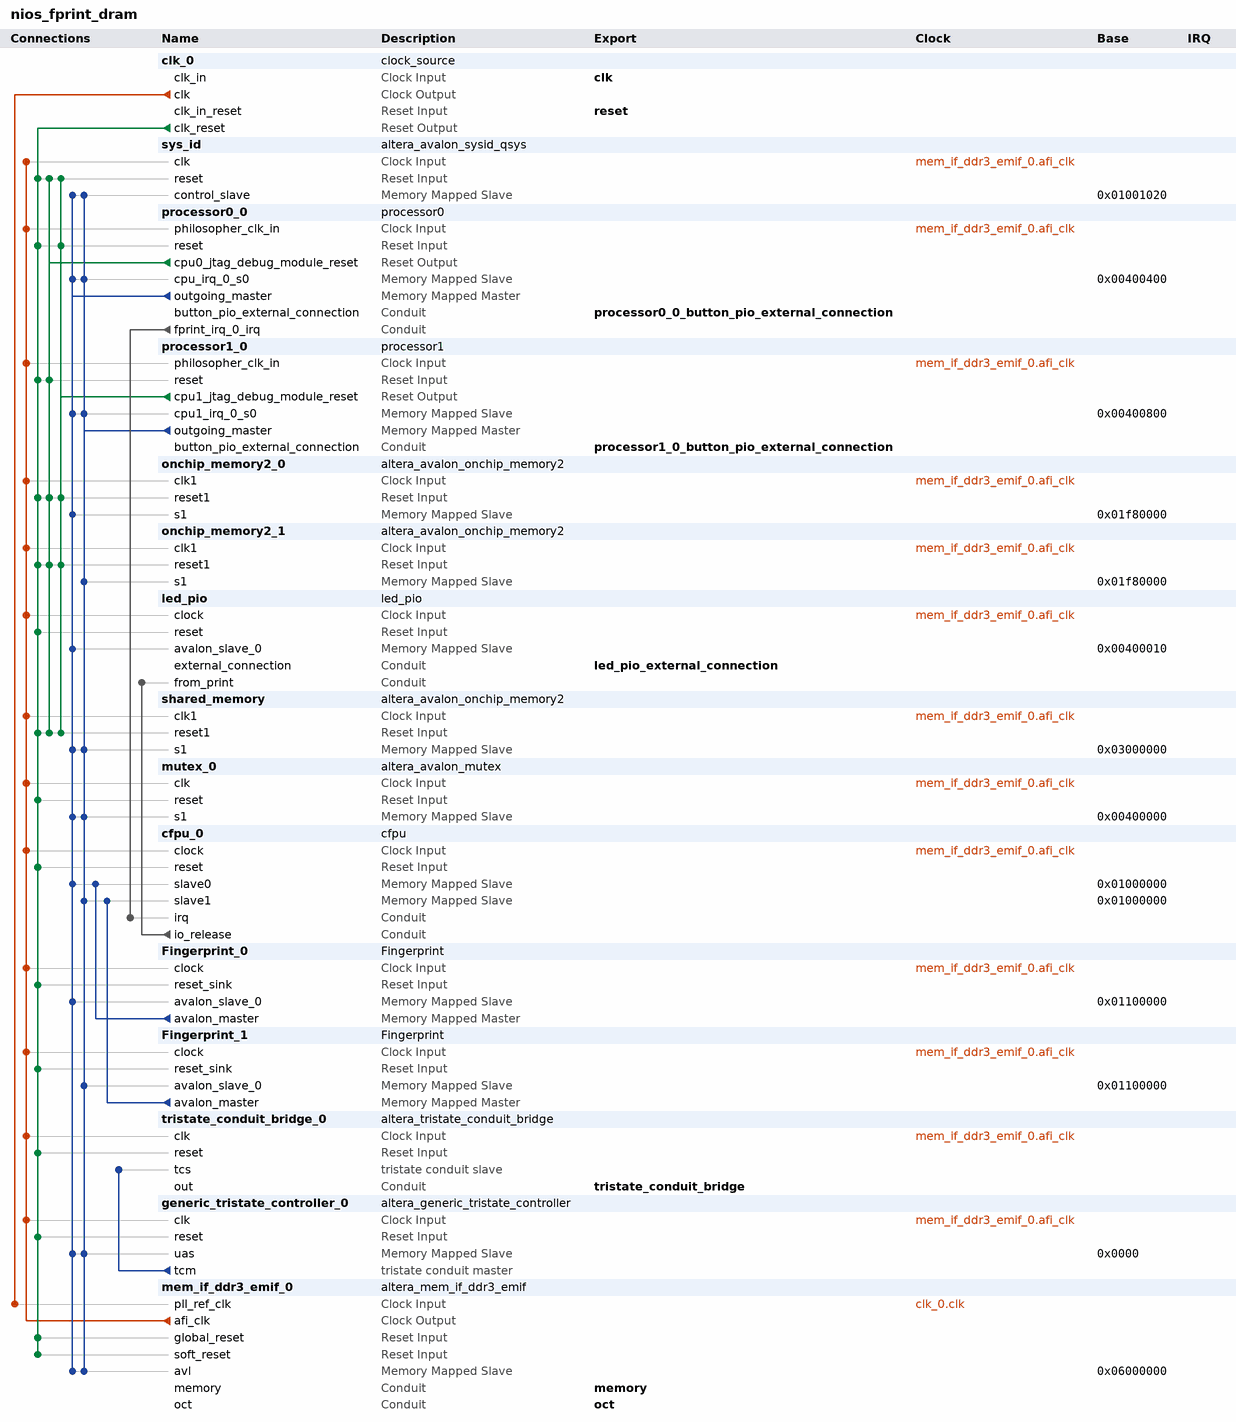
[diagram p0: system contents]
# Platform Designer (Qsys) system nios_fprint_dram, Arria V 5AGXFB3H4F35C5
# Parameters at their usual value, and those the tool derives, are not listed.
package require -exact qsys 13.0
create_system nios_fprint_dram
set_project_property DEVICE_FAMILY {Arria V}
set_project_property DEVICE 5AGXFB3H4F35C5

add_instance clk_0 clock_source 13.0
set_instance_parameter_value clk_0 clockFrequency 50000000

add_instance sys_id altera_avalon_sysid_qsys 13.0
set_instance_parameter_value sys_id id 0

add_instance processor0_0 processor0 1.0

add_instance processor1_0 processor1 1.0

add_instance onchip_memory2_0 altera_avalon_onchip_memory2 13.0.1.99.2
set_instance_parameter_value onchip_memory2_0 dataWidth 32
set_instance_parameter_value onchip_memory2_0 dualPort false
set_instance_parameter_value onchip_memory2_0 initMemContent true
set_instance_parameter_value onchip_memory2_0 initializationFileName onchip_mem.hex
set_instance_parameter_value onchip_memory2_0 memorySize 409600

add_instance onchip_memory2_1 altera_avalon_onchip_memory2 13.0.1.99.2
set_instance_parameter_value onchip_memory2_1 dataWidth 32
set_instance_parameter_value onchip_memory2_1 dualPort false
set_instance_parameter_value onchip_memory2_1 initMemContent true
set_instance_parameter_value onchip_memory2_1 initializationFileName onchip_mem.hex
set_instance_parameter_value onchip_memory2_1 memorySize 409600

add_instance led_pio led_pio 1.0

add_instance shared_memory altera_avalon_onchip_memory2 13.0.1.99.2
set_instance_parameter_value shared_memory dataWidth 32
set_instance_parameter_value shared_memory dualPort false
set_instance_parameter_value shared_memory initMemContent true
set_instance_parameter_value shared_memory initializationFileName onchip_mem.hex
set_instance_parameter_value shared_memory memorySize 1024

add_instance mutex_0 altera_avalon_mutex 13.0.1.99.2

add_instance cfpu_0 cfpu 1.0

add_instance Fingerprint_0 Fingerprint 1.0

add_instance Fingerprint_1 Fingerprint 1.0

add_instance tristate_conduit_bridge_0 altera_tristate_conduit_bridge 13.0

add_instance generic_tristate_controller_0 altera_generic_tristate_controller 13.0
set_instance_parameter_value generic_tristate_controller_0 TCM_ADDRESS_W 22
set_instance_parameter_value generic_tristate_controller_0 TCM_DATA_W 16
set_instance_parameter_value generic_tristate_controller_0 TCM_BYTEENABLE_W 2
set_instance_parameter_value generic_tristate_controller_0 TCM_READ_WAIT 100
set_instance_parameter_value generic_tristate_controller_0 TCM_WRITE_WAIT 100
set_instance_parameter_value generic_tristate_controller_0 TCM_SETUP_WAIT 25
set_instance_parameter_value generic_tristate_controller_0 TCM_DATA_HOLD 20
set_instance_parameter_value generic_tristate_controller_0 TCM_MAX_PENDING_READ_TRANSACTIONS 3
set_instance_parameter_value generic_tristate_controller_0 TCM_TURNAROUND_TIME 2
set_instance_parameter_value generic_tristate_controller_0 TCM_TIMING_UNITS 0
set_instance_parameter_value generic_tristate_controller_0 TCM_READLATENCY 2
set_instance_parameter_value generic_tristate_controller_0 TCM_SYMBOLS_PER_WORD 2
set_instance_parameter_value generic_tristate_controller_0 USE_READ 1
set_instance_parameter_value generic_tristate_controller_0 USE_BEGINTRANSFER 0
set_instance_parameter_value generic_tristate_controller_0 USE_BYTEENABLE 0
set_instance_parameter_value generic_tristate_controller_0 USE_OUTPUTENABLE 0
set_instance_parameter_value generic_tristate_controller_0 ACTIVE_LOW_READ 1
set_instance_parameter_value generic_tristate_controller_0 ACTIVE_LOW_BYTEENABLE 0
set_instance_parameter_value generic_tristate_controller_0 ACTIVE_LOW_OUTPUTENABLE 0
set_instance_parameter_value generic_tristate_controller_0 ACTIVE_LOW_BEGINTRANSFER 0
set_instance_parameter_value generic_tristate_controller_0 CHIPSELECT_THROUGH_READLATENCY 0
set_instance_parameter_value generic_tristate_controller_0 MODULE_ASSIGNMENT_KEYS embeddedsw.configuration.hwClassnameDriverSupportList,embeddedsw.configuration.hwClassnameDriverSupportDefault,embeddedsw.CMacro.SETUP_VALUE,embeddedsw.CMacro.WAIT_VALUE,embeddedsw.CMacro.HOLD_VALUE,embeddedsw.CMacro.TIMING_UNITS,embeddedsw.CMacro.SIZE,embeddedsw.memoryInfo.MEM_INIT_DATA_WIDTH,embeddedsw.memoryInfo.HAS_BYTE_LANE,embeddedsw.memoryInfo.IS_FLASH,embeddedsw.memoryInfo.GENERATE_DAT_SYM,embeddedsw.memoryInfo.GENERATE_FLASH,embeddedsw.memoryInfo.DAT_SYM_INSTALL_DIR,embeddedsw.memoryInfo.FLASH_INSTALL_DIR
set_instance_parameter_value generic_tristate_controller_0 MODULE_ASSIGNMENT_VALUES altera_avalon_lan91c111:altera_avalon_cfi_flash,altera_avalon_cfi_flash,25,100,20,ns,33554432u,16,1,1,1,1,SIM_DIR,APP_DIR
set_instance_parameter_value generic_tristate_controller_0 INTERFACE_ASSIGNMENT_KEYS embeddedsw.configuration.isFlash,embeddedsw.configuration.isMemoryDevice,embeddedsw.configuration.isNonVolatileStorage
set_instance_parameter_value generic_tristate_controller_0 INTERFACE_ASSIGNMENT_VALUES 1,1,1

add_instance mem_if_ddr3_emif_0 altera_mem_if_ddr3_emif 13.0
set_instance_parameter_value mem_if_ddr3_emif_0 MEM_VENDOR Micron
set_instance_parameter_value mem_if_ddr3_emif_0 MEM_FORMAT DISCRETE
set_instance_parameter_value mem_if_ddr3_emif_0 MEM_CLK_FREQ_MAX 666.667
set_instance_parameter_value mem_if_ddr3_emif_0 MEM_ROW_ADDR_WIDTH 13
set_instance_parameter_value mem_if_ddr3_emif_0 MEM_COL_ADDR_WIDTH 8
set_instance_parameter_value mem_if_ddr3_emif_0 MEM_DQ_WIDTH 32
set_instance_parameter_value mem_if_ddr3_emif_0 MEM_BANKADDR_WIDTH 2
set_instance_parameter_value mem_if_ddr3_emif_0 MEM_DRV_STR RZQ/6
set_instance_parameter_value mem_if_ddr3_emif_0 MEM_RTT_NOM RZQ/4
set_instance_parameter_value mem_if_ddr3_emif_0 MEM_WTCL 7
set_instance_parameter_value mem_if_ddr3_emif_0 MEM_TCL 9
set_instance_parameter_value mem_if_ddr3_emif_0 TIMING_TIS 190
set_instance_parameter_value mem_if_ddr3_emif_0 TIMING_TIH 140
set_instance_parameter_value mem_if_ddr3_emif_0 TIMING_TDS 30
set_instance_parameter_value mem_if_ddr3_emif_0 TIMING_TDH 65
set_instance_parameter_value mem_if_ddr3_emif_0 TIMING_TDQSQ 125
set_instance_parameter_value mem_if_ddr3_emif_0 TIMING_TDQSCK 255
set_instance_parameter_value mem_if_ddr3_emif_0 TIMING_TDQSS 0.25
set_instance_parameter_value mem_if_ddr3_emif_0 TIMING_TQSH 0.4
set_instance_parameter_value mem_if_ddr3_emif_0 TIMING_TDSH 0.2
set_instance_parameter_value mem_if_ddr3_emif_0 TIMING_TDSS 0.2
set_instance_parameter_value mem_if_ddr3_emif_0 MEM_TRAS_NS 36.0
set_instance_parameter_value mem_if_ddr3_emif_0 MEM_TRCD_NS 13.5
set_instance_parameter_value mem_if_ddr3_emif_0 MEM_TRP_NS 13.5
set_instance_parameter_value mem_if_ddr3_emif_0 MEM_TRFC_NS 110.0
set_instance_parameter_value mem_if_ddr3_emif_0 MEM_TWTR 4
set_instance_parameter_value mem_if_ddr3_emif_0 MEM_TFAW_NS 45.0
set_instance_parameter_value mem_if_ddr3_emif_0 MEM_TRRD_NS 7.5
set_instance_parameter_value mem_if_ddr3_emif_0 MEM_TRTP_NS 7.5
set_instance_parameter_value mem_if_ddr3_emif_0 RATE Quarter
set_instance_parameter_value mem_if_ddr3_emif_0 MEM_CLK_FREQ 300.0
set_instance_parameter_value mem_if_ddr3_emif_0 SPEED_GRADE 4
set_instance_parameter_value mem_if_ddr3_emif_0 HARD_EMIF false
set_instance_parameter_value mem_if_ddr3_emif_0 POWER_OF_TWO_BUS true
set_instance_parameter_value mem_if_ddr3_emif_0 AVL_MAX_SIZE 64
set_instance_parameter_value mem_if_ddr3_emif_0 BYTE_ENABLE false
set_instance_parameter_value mem_if_ddr3_emif_0 PRIORITY_PORT 1,1,1,1,1,1
set_instance_parameter_value mem_if_ddr3_emif_0 CPORT_TYPE_PORT Bidirectional,Bidirectional,Bidirectional,Bidirectional,Bidirectional,Bidirectional
set_instance_parameter_value mem_if_ddr3_emif_0 REF_CLK_FREQ 50.0
set_instance_parameter_value mem_if_ddr3_emif_0 DEFAULT_FAST_SIM_MODEL true
set_instance_parameter_value mem_if_ddr3_emif_0 EXPORT_AFI_HALF_CLK false
set_instance_parameter_value mem_if_ddr3_emif_0 PLL_LOCATION Top_Bottom
set_instance_parameter_value mem_if_ddr3_emif_0 CALIBRATION_MODE Skip
set_instance_parameter_value mem_if_ddr3_emif_0 USER_DEBUG_LEVEL 1
set_instance_parameter_value mem_if_ddr3_emif_0 TIMING_BOARD_DERATE_METHOD SLEW_RATE
set_instance_parameter_value mem_if_ddr3_emif_0 TIMING_BOARD_MAX_CK_DELAY 0.42
set_instance_parameter_value mem_if_ddr3_emif_0 TIMING_BOARD_MAX_DQS_DELAY 0.437
set_instance_parameter_value mem_if_ddr3_emif_0 TIMING_BOARD_SKEW_CKDQS_DIMM_MIN -0.0039
set_instance_parameter_value mem_if_ddr3_emif_0 TIMING_BOARD_SKEW_CKDQS_DIMM_MAX 0.012
set_instance_parameter_value mem_if_ddr3_emif_0 TIMING_BOARD_SKEW_WITHIN_DQS 0.011
set_instance_parameter_value mem_if_ddr3_emif_0 TIMING_BOARD_SKEW_BETWEEN_DQS 0.029
set_instance_parameter_value mem_if_ddr3_emif_0 TIMING_BOARD_DQ_TO_DQS_SKEW -0.0040
set_instance_parameter_value mem_if_ddr3_emif_0 TIMING_BOARD_AC_SKEW 0.0039
set_instance_parameter_value mem_if_ddr3_emif_0 TIMING_BOARD_AC_TO_CK_SKEW -0.0010

# connections
add_connection clk_0.clk mem_if_ddr3_emif_0.pll_ref_clk clock
add_connection mem_if_ddr3_emif_0.afi_clk cfpu_0.clock clock
add_connection mem_if_ddr3_emif_0.afi_clk Fingerprint_0.clock clock
add_connection mem_if_ddr3_emif_0.afi_clk Fingerprint_1.clock clock
add_connection mem_if_ddr3_emif_0.afi_clk generic_tristate_controller_0.clk clock
add_connection mem_if_ddr3_emif_0.afi_clk led_pio.clock clock
add_connection mem_if_ddr3_emif_0.afi_clk mutex_0.clk clock
add_connection mem_if_ddr3_emif_0.afi_clk onchip_memory2_0.clk1 clock
add_connection mem_if_ddr3_emif_0.afi_clk onchip_memory2_1.clk1 clock
add_connection mem_if_ddr3_emif_0.afi_clk processor0_0.philosopher_clk_in clock
add_connection mem_if_ddr3_emif_0.afi_clk processor1_0.philosopher_clk_in clock
add_connection mem_if_ddr3_emif_0.afi_clk shared_memory.clk1 clock
add_connection mem_if_ddr3_emif_0.afi_clk sys_id.clk clock
add_connection mem_if_ddr3_emif_0.afi_clk tristate_conduit_bridge_0.clk clock
add_connection clk_0.clk_reset cfpu_0.reset reset
add_connection clk_0.clk_reset Fingerprint_0.reset_sink reset
add_connection clk_0.clk_reset Fingerprint_1.reset_sink reset
add_connection clk_0.clk_reset generic_tristate_controller_0.reset reset
add_connection clk_0.clk_reset led_pio.reset reset
add_connection clk_0.clk_reset mem_if_ddr3_emif_0.global_reset reset
add_connection clk_0.clk_reset mem_if_ddr3_emif_0.soft_reset reset
add_connection clk_0.clk_reset mutex_0.reset reset
add_connection clk_0.clk_reset onchip_memory2_0.reset1 reset
add_connection clk_0.clk_reset onchip_memory2_1.reset1 reset
add_connection clk_0.clk_reset processor0_0.reset reset
add_connection clk_0.clk_reset processor1_0.reset reset
add_connection clk_0.clk_reset shared_memory.reset1 reset
add_connection clk_0.clk_reset sys_id.reset reset
add_connection clk_0.clk_reset tristate_conduit_bridge_0.reset reset
add_connection processor0_0.cpu0_jtag_debug_module_reset onchip_memory2_0.reset1 reset
add_connection processor0_0.cpu0_jtag_debug_module_reset onchip_memory2_1.reset1 reset
add_connection processor0_0.cpu0_jtag_debug_module_reset processor1_0.reset reset
add_connection processor0_0.cpu0_jtag_debug_module_reset shared_memory.reset1 reset
add_connection processor0_0.cpu0_jtag_debug_module_reset sys_id.reset reset
add_connection processor1_0.cpu1_jtag_debug_module_reset onchip_memory2_0.reset1 reset
add_connection processor1_0.cpu1_jtag_debug_module_reset onchip_memory2_1.reset1 reset
add_connection processor1_0.cpu1_jtag_debug_module_reset processor0_0.reset reset
add_connection processor1_0.cpu1_jtag_debug_module_reset shared_memory.reset1 reset
add_connection processor1_0.cpu1_jtag_debug_module_reset sys_id.reset reset
add_connection Fingerprint_0.avalon_master cfpu_0.slave0 avalon
set_connection_parameter_value Fingerprint_0.avalon_master/cfpu_0.slave0 baseAddress 0x01000000
add_connection Fingerprint_1.avalon_master cfpu_0.slave1 avalon
set_connection_parameter_value Fingerprint_1.avalon_master/cfpu_0.slave1 baseAddress 0x01000000
add_connection processor0_0.outgoing_master cfpu_0.slave0 avalon
set_connection_parameter_value processor0_0.outgoing_master/cfpu_0.slave0 baseAddress 0x01000000
add_connection processor0_0.outgoing_master Fingerprint_0.avalon_slave_0 avalon
set_connection_parameter_value processor0_0.outgoing_master/Fingerprint_0.avalon_slave_0 baseAddress 0x01100000
add_connection processor0_0.outgoing_master generic_tristate_controller_0.uas avalon
set_connection_parameter_value processor0_0.outgoing_master/generic_tristate_controller_0.uas baseAddress 0x0000
add_connection processor0_0.outgoing_master led_pio.avalon_slave_0 avalon
set_connection_parameter_value processor0_0.outgoing_master/led_pio.avalon_slave_0 baseAddress 0x00400010
add_connection processor0_0.outgoing_master mem_if_ddr3_emif_0.avl avalon
set_connection_parameter_value processor0_0.outgoing_master/mem_if_ddr3_emif_0.avl baseAddress 0x06000000
add_connection processor0_0.outgoing_master mutex_0.s1 avalon
set_connection_parameter_value processor0_0.outgoing_master/mutex_0.s1 baseAddress 0x00400000
add_connection processor0_0.outgoing_master onchip_memory2_0.s1 avalon
set_connection_parameter_value processor0_0.outgoing_master/onchip_memory2_0.s1 baseAddress 0x01f80000
add_connection processor0_0.outgoing_master processor0_0.cpu_irq_0_s0 avalon
set_connection_parameter_value processor0_0.outgoing_master/processor0_0.cpu_irq_0_s0 baseAddress 0x00400400
add_connection processor0_0.outgoing_master processor1_0.cpu1_irq_0_s0 avalon
set_connection_parameter_value processor0_0.outgoing_master/processor1_0.cpu1_irq_0_s0 baseAddress 0x00400800
add_connection processor0_0.outgoing_master shared_memory.s1 avalon
set_connection_parameter_value processor0_0.outgoing_master/shared_memory.s1 baseAddress 0x03000000
add_connection processor0_0.outgoing_master sys_id.control_slave avalon
set_connection_parameter_value processor0_0.outgoing_master/sys_id.control_slave baseAddress 0x01001020
add_connection processor1_0.outgoing_master cfpu_0.slave1 avalon
set_connection_parameter_value processor1_0.outgoing_master/cfpu_0.slave1 baseAddress 0x01000000
add_connection processor1_0.outgoing_master Fingerprint_1.avalon_slave_0 avalon
set_connection_parameter_value processor1_0.outgoing_master/Fingerprint_1.avalon_slave_0 baseAddress 0x01100000
add_connection processor1_0.outgoing_master generic_tristate_controller_0.uas avalon
set_connection_parameter_value processor1_0.outgoing_master/generic_tristate_controller_0.uas baseAddress 0x0000
add_connection processor1_0.outgoing_master mem_if_ddr3_emif_0.avl avalon
set_connection_parameter_value processor1_0.outgoing_master/mem_if_ddr3_emif_0.avl baseAddress 0x06000000
add_connection processor1_0.outgoing_master mutex_0.s1 avalon
set_connection_parameter_value processor1_0.outgoing_master/mutex_0.s1 baseAddress 0x00400000
add_connection processor1_0.outgoing_master onchip_memory2_1.s1 avalon
set_connection_parameter_value processor1_0.outgoing_master/onchip_memory2_1.s1 baseAddress 0x01f80000
add_connection processor1_0.outgoing_master processor0_0.cpu_irq_0_s0 avalon
set_connection_parameter_value processor1_0.outgoing_master/processor0_0.cpu_irq_0_s0 baseAddress 0x00400400
add_connection processor1_0.outgoing_master processor1_0.cpu1_irq_0_s0 avalon
set_connection_parameter_value processor1_0.outgoing_master/processor1_0.cpu1_irq_0_s0 baseAddress 0x00400800
add_connection processor1_0.outgoing_master shared_memory.s1 avalon
set_connection_parameter_value processor1_0.outgoing_master/shared_memory.s1 baseAddress 0x03000000
add_connection processor1_0.outgoing_master sys_id.control_slave avalon
set_connection_parameter_value processor1_0.outgoing_master/sys_id.control_slave baseAddress 0x01001020
add_connection cfpu_0.io_release led_pio.from_print conduit
add_connection processor0_0.fprint_irq_0_irq cfpu_0.irq conduit
add_connection generic_tristate_controller_0.tcm tristate_conduit_bridge_0.tcs tristate_conduit

# exported interfaces
add_interface clk clock sink
set_interface_property clk EXPORT_OF clk_0.clk_in
add_interface led_pio_external_connection conduit end
set_interface_property led_pio_external_connection EXPORT_OF led_pio.external_connection
add_interface processor1_0_button_pio_external_connection conduit end
set_interface_property processor1_0_button_pio_external_connection EXPORT_OF processor1_0.button_pio_external_connection
add_interface processor0_0_button_pio_external_connection conduit end
set_interface_property processor0_0_button_pio_external_connection EXPORT_OF processor0_0.button_pio_external_connection
add_interface reset reset sink
set_interface_property reset EXPORT_OF clk_0.clk_in_reset
add_interface tristate_conduit_bridge conduit end
set_interface_property tristate_conduit_bridge EXPORT_OF tristate_conduit_bridge_0.out
add_interface memory conduit end
set_interface_property memory EXPORT_OF mem_if_ddr3_emif_0.memory
add_interface oct conduit end
set_interface_property oct EXPORT_OF mem_if_ddr3_emif_0.oct

set_interconnect_requirement {$system} qsys_mm.clockCrossingAdapter HANDSHAKE
set_interconnect_requirement {$system} qsys_mm.maxAdditionalLatency 1

save_system nios_fprint_dram.qsys
